# Altium schematic sheet supply.SchDoc: Supply regulation
size A4; Author: Samuel López; DocumentNumber: 6; SheetNumber: 6; SheetTotal: 6
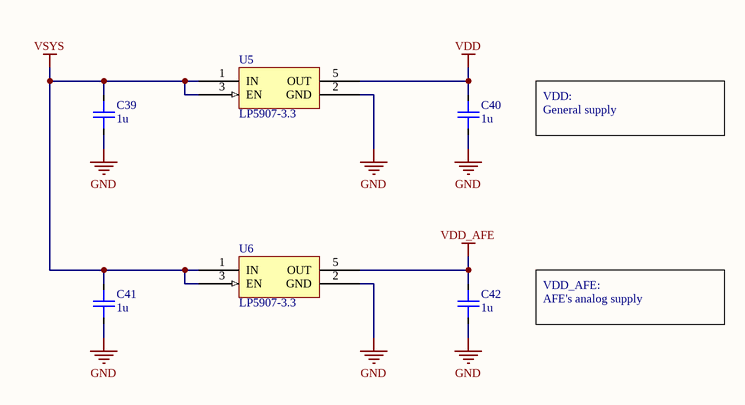
[diagram p0: supply.SchDoc]

## Parts
C39  1u  [C0402]
C40  1u  [C0402]
C41  1u  [C0402]
C42  1u  [C0402]
U5  LP5907-3.3  [LP5907]
U6  LP5907-3.3  [LP5907]

## Nets
GND: C39.1 C40.1 C41.1 C42.1 U5.2(GND) U6.2(GND)
VDD: C40.2 U5.5(OUT)
VDD_AFE: C42.2 U6.5(OUT)
VSYS: C39.2 C41.2 U5.1(IN) U5.3(EN) U6.1(IN) U6.3(EN)

## Notes on the sheet
- VDD:
  General supply
- VDD_AFE:
  AFE's analog supply
- Title:
- Sheet
- of
- Author:
- Date:
- Time:

## Library data of the parts
C39-C42 = Capacitor: Value: 1u; Rated Voltage: *
U5 U6 = LP5907-3.3: IC - Voltage Regulator, Linear; Supplier 1: Digi-Key; Supplier Part Number 1: 296-38557-1-ND